# EAGLE schematic 117_02_TIMER_GATE (EAGLE 9.6.2)
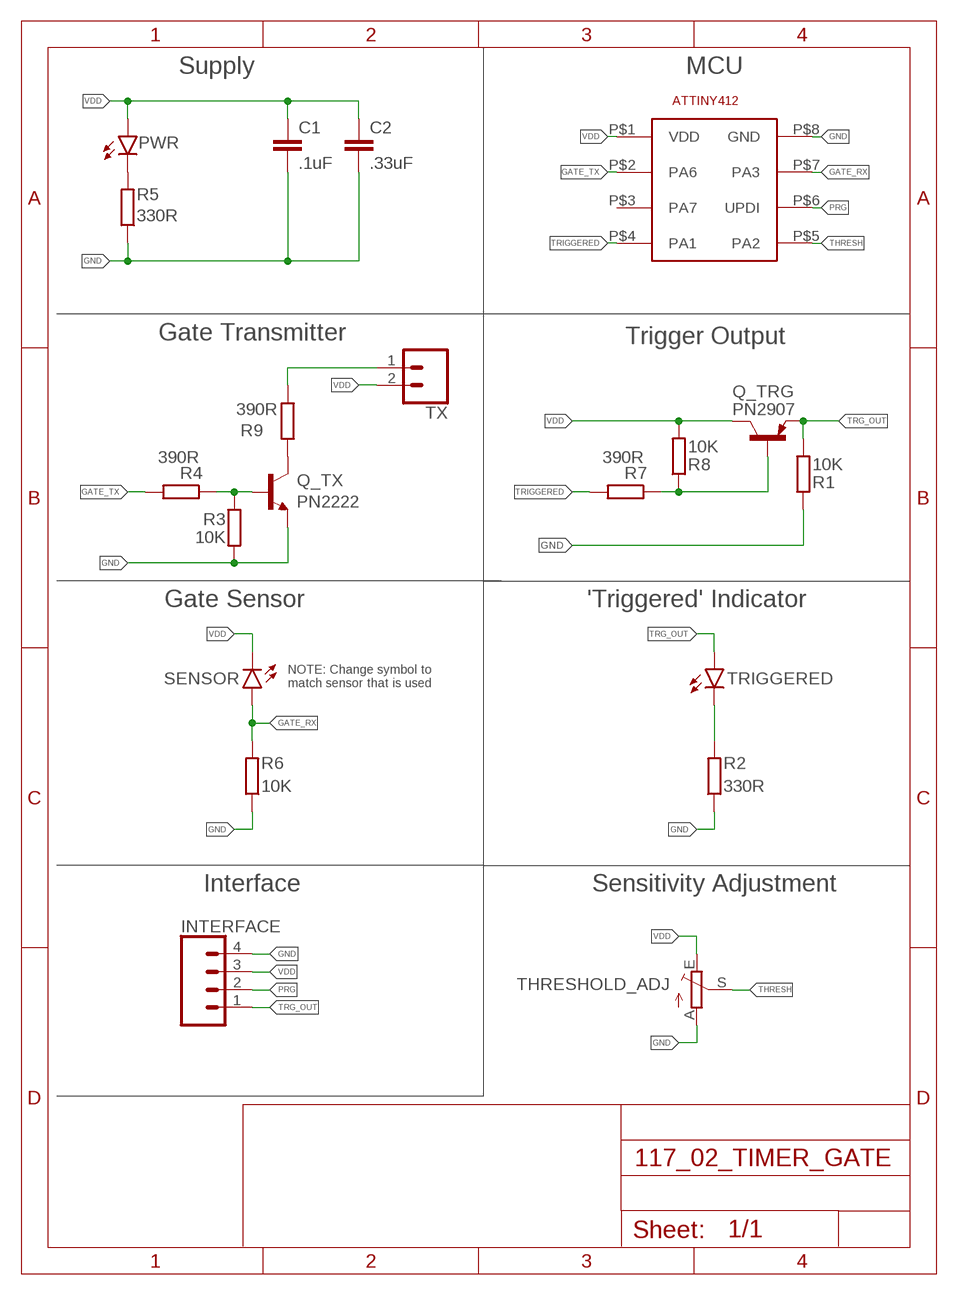
[diagram p0: schematic, sheet 1]

## Parts
C1  .1uF  C-EUC0805K  [C0805K]
C2  .33uF  C-EUC0805K  [C0805K]
INTERFACE  CONN_04LONGPADS  [1X04_LONGPADS]
PWR  LEDSML0805  [SML0805]
Q_TRG  PN2907  2N4126-PNP-TO92-CBE  [TO92-CBE]
Q_TX  PN2222  2N2222-NPN-TO92-EBC  [TO92-EBC]
R1  10K  R-EU_M0805  [M0805]
R2  330R  R-EU_M0805  [M0805]
R3  10K  R-EU_M0805  [M0805]
R4  390R  R-EU_M0805  [M0805]
R5  330R  R-EU_M0805  [M0805]
R6  10K  R-EU_M0805  [M0805]
R7  390R  R-EU_M0805  [M0805]
R8  10K  R-EU_M0805  [M0805]
R9  390R  R-EU_M0805  [M0805]
SENSOR  LED5MM  [LED_5MM]
THRESHOLD_ADJ  TRIM_EU-S64W  [S64W]
TRIGGERED  LED5MM  [LED_5MM]
TX  CONN_02PTH3  [1X02_LONGPADS]
U$1  ATTINY412  [ATTINY412]

## Nets
GATE_RX: R6.2 SENSOR.A U$1.P$7(PA3)
GATE_TX: R4.2 U$1.P$2(PA6)
GND: C1.2 C2.2 INTERFACE.4 Q_TX.E R1.1 R2.1 R3.2 R5.1 R6.1 THRESHOLD_ADJ.A U$1.P$8(GND)
N$1: PWR.C R5.2
N$2: R9.1 TX.1
N$4: Q_TX.B R3.1 R4.1
N$5: Q_TX.C R9.2
N$10: R2.2 TRIGGERED.K(C)
PRG: INTERFACE.2 U$1.P$6(UPDI)
THRESH: THRESHOLD_ADJ.S U$1.P$5(PA2)
TRG_BASE: Q_TRG.B R7.1 R8.1
TRG_OUT: INTERFACE.1 Q_TRG.E R1.2 TRIGGERED.A
TRIGGERED: R7.2 U$1.P$4(PA1)
VDD: C1.1 C2.1 INTERFACE.3 PWR.A Q_TRG.C R8.2 SENSOR.K(C) THRESHOLD_ADJ.E TX.2 U$1.P$1(VDD)
Unconnected: U$1.P$3(PA7)

## Notes on the sheet
- Supply | MCU
- Gate Transmitter | Trigger Output
- Gate Sensor | 'Triggered' Indicator
- NOTE: Change symbol to 
  match sensor that is used
- Interface | Sensitivity Adjustment

## Library data of the parts
C1 C2 = rcl:C-EU: CAPACITOR, European symbol; SPICEPREFIX: C
INTERFACE = SparkFun-Connectors:CONN_04: Multi connection point. Often used as Generic Header-pin footprint for 0.1 inch spaced/style header connections On any of the 0.1 inch spaced packages, you can populate with these: Break Away Headers - Straight <https://www.sparkfun.com/products/116> (PRT-00116) Break Away Male Headers - Right Angle <https://www.sparkfun.com/products/553> (PRT-00553) Female Headers <https://www.sparkfun.com/products/115> (PRT-00115) Break Away Headers - Machine Pin <https://www.sparkfun.com/products/117> (PRT-00117) Break Away Female Headers - Swiss Machine Pin <https://www.sparkfun.com/products/743> (PRT-00743) For SCREWTERMINALS and SPRING TERMINALS visit here: Screw Terimnals on SparkFun.com <https://www.sparkfun.com/search/results?term=Screw+Terminals> (5mm/3.5mm/2.54mm spacing) This device is also useful as a general connection point to wire up your design to another part of your project. Our various solder wires solder well into these plated through hole pads. Hook-Up Wire - Assortment (Stranded, 22 AWG) <https://www.sparkfun.com/products/11375> (PRT-11375) Hook-Up Wire - Assortment (Solid Core, 22 AWG) <https://www.sparkfun.com/products/11367> (PRT-11367) View the entire wire category on our website here <https://www.sparkfun.com/categories/141> Special notes: Molex polarized connector foot print use with SKU : PRT-08231 with associated crimp pins and housings. 1MM SMD Version SKU: PRT-10208; PROD_ID: CONN-09696
PWR = led:LED: LED OSRAM: - CHIPLED LG R971, LG N971, LY N971, LG Q971, LY Q971, LO R971, LY R971 LH N974, LH R974 LS Q976, LO Q976, LY Q976 LO Q996 - Hyper CHIPLED LW Q18S LB Q993, LB Q99A, LB R99A - SideLED LS A670, LO A670, LY A670, LG A670, LP A670 LB A673, LV A673, LT A673, LW A673 LH A674 LY A675 LS A676, LA A676, LO A676, LY A676, LW A676 LS A679, LY A679, LG A679 - Hyper Micro SIDELED® LS Y876, LA Y876, LO Y876, LY Y876 LT Y87S - SmartLED LW L88C, LW L88S LB L89C, LB L89S, LG L890 LS L89K, LO L89K, LY L89K LS L896, LA L896, LO L896, LY L896 - TOPLED LS T670, LO T670, LY T670, LG T670, LP T670 LSG T670, LSP T670, LSY T670, LOP T670, LYG T670 LG T671, LOG T671, LSG T671 LB T673, LV T673, LT T673, LW T673 LH T674 LS T676, LA T676, LO T676, LY T676, LB T676, LH T676, LSB T676, LW T676 LB T67C, LV T67C, LT T67C, LS T67K, LO T67K, LY T67K, LW E67C LS E67B, LA E67B, LO E67B, LY E67B, LB E67C, LV E67C, LT E67C LW T67C LS T679, LY T679, LG T679 LS T770, LO T770, LY T770, LG T770, LP T770 LB T773, LV T773, LT T773, LW T773 LH T774 LS E675, LA E675, LY E675, LS T675 LS T776, LA T776, LO T776, LY T776, LB T776 LHGB T686 LT T68C, LB T68C - Hyper Mini TOPLED® LB M676 - Mini TOPLED Santana® LG M470 LS M47K, LO M47K, LY M47K Source: http://www.osram.convergy.de LUXEON: - LUMILED® LXK2-PW12-R00, LXK2-PW12-S00, LXK2-PW14-U00, LXK2-PW14-V00 LXK2-PM12-R00, LXK2-PM12-S00, LXK2-PM14-U00 LXK2-PE12-Q00, LXK2-PE12-R00, LXK2-PE12-S00, LXK2-PE14-T00, LXK2-PE14-U00 LXK2-PB12-K00, LXK2-PB12-L00, LXK2-PB12-M00, LXK2-PB14-N00, LXK2-PB14-P00, LXK2-PB14-Q00 LXK2-PR12-L00, LXK2-PR12-M00, LXK2-PR14-Q00, LXK2-PR14-R00 LXK2-PD12-Q00, LXK2-PD12-R00, LXK2-PD12-S00 LXK2-PH12-R00, LXK2-PH12-S00 LXK2-PL12-P00, LXK2-PL12-Q00, LXK2-PL12-R00 Source: www.luxeon.com KINGBRIGHT: KA-3528ASYC Source: www.kingbright.com
Q_TRG = transistor:*-PNP-: PNP Transistror
Q_TX = transistor-neu-to92:*-NPN-: NPN Transistror
R1-R9 = rcl:R-EU_: RESISTOR, European symbol; SPICEPREFIX: R
SENSOR TRIGGERED = SparkFun-LED:LED: LED (Generic) Standard schematic elements and footprints for 5mm, 3mm, 1206, and 0603 sized LEDs. Generic LEDs with no color specified.
THRESHOLD_ADJ = pot:TRIM_EU-: POTENTIOMETER
TX = SparkFun-Connectors:CONN_02: Multi connection point. Often used as Generic Header-pin footprint for 0.1 inch spaced/style header connections On any of the 0.1 inch spaced packages, you can populate with these: Break Away Headers - Straight <https://www.sparkfun.com/products/116> (PRT-00116) Break Away Male Headers - Right Angle <https://www.sparkfun.com/products/553> (PRT-00553) Female Headers <https://www.sparkfun.com/products/115> (PRT-00115) Break Away Headers - Machine Pin <https://www.sparkfun.com/products/117> (PRT-00117) Break Away Female Headers - Swiss Machine Pin <https://www.sparkfun.com/products/743> (PRT-00743) For SCREWTERMINALS and SPRING TERMINALS visit here: Screw Terimnals on SparkFun.com <https://www.sparkfun.com/search/results?term=Screw+Terminals> (5mm/3.5mm/2.54mm spacing) This device is also useful as a general connection point to wire up your design to another part of your project. Our various solder wires solder well into these plated through hole pads. Hook-Up Wire - Assortment (Stranded, 22 AWG) <https://www.sparkfun.com/products/11375> (PRT-11375) Hook-Up Wire - Assortment (Solid Core, 22 AWG) <https://www.sparkfun.com/products/11367> (PRT-11367) View the entire wire category on our website here <https://www.sparkfun.com/categories/141> Special notes: Molex polarized connector foot print use with: PRT-08233 with associated crimp pins and housings. 2.54_SCREWTERM for use with PRT-10571. 3.5mm Screw Terminal footprints for PRT-08084 5mm Screw Terminal footprints for use with PRT-08432
U$1 = Stephen:ATTINY412